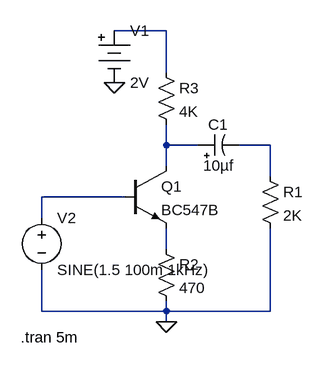
[diagram p0: schematic Circuit debugging.asc]
Circuit debugging.asc, the LTspice schematic file:
Version 4.1
SHEET 1 880 680
WIRE 224 -96 144 -96
WIRE 224 -32 224 -96
WIRE 224 80 224 48
WIRE 272 80 224 80
WIRE 384 80 336 80
WIRE 224 112 224 80
WIRE 384 128 384 80
WIRE 160 160 32 160
WIRE 32 192 32 160
WIRE 224 240 224 208
WIRE 32 336 32 272
WIRE 224 336 224 320
WIRE 224 336 32 336
WIRE 384 336 384 208
WIRE 384 336 224 336
WIRE 224 352 224 336
FLAG 224 352 0
FLAG 144 -16 0
SYMBOL npn 160 112 R0
SYMATTR InstName Q1
SYMATTR Value BC547B
SYMBOL polcap 272 96 R270
WINDOW 0 32 32 VTop 2
WINDOW 3 0 32 VBottom 2
SYMATTR InstName C1
SYMATTR Value 10µf
SYMBOL res 368 112 R0
SYMATTR InstName R1
SYMATTR Value 2K
SYMBOL res 208 224 R0
SYMATTR InstName R2
SYMATTR Value 470
SYMBOL res 208 -48 R0
SYMATTR InstName R3
SYMATTR Value 4K
SYMATTR SpiceLine tol=1 pwr=0.1
SYMBOL Misc\\battery 144 -112 R0
WINDOW 123 0 0 Left 0
WINDOW 39 0 0 Left 0
SYMATTR InstName V1
SYMATTR Value 2V
SYMBOL voltage 32 176 R0
WINDOW 123 0 0 Left 0
WINDOW 39 0 0 Left 0
SYMATTR InstName V2
SYMATTR Value SINE(1.5 100m 1kHz)
TEXT 0 376 Left 2 !.tran 5m

The netlist it stands for:
* Circuit debugging.asc
Q1 N002 N004 N005 0 BC547B
C1 N002 N003 10µf
R1 N003 0 2K
R2 N005 0 470
R3 N001 N002 4K tol=1 pwr=0.1
V1 N001 0 2V
V2 N004 0 SINE(1.5 100m 1kHz)
.model NPN NPN
.model PNP PNP
.lib standard.bjt
.tran 5m
.backanno
.end